# EAGLE design 605_motor (EAGLE 9.6.2)
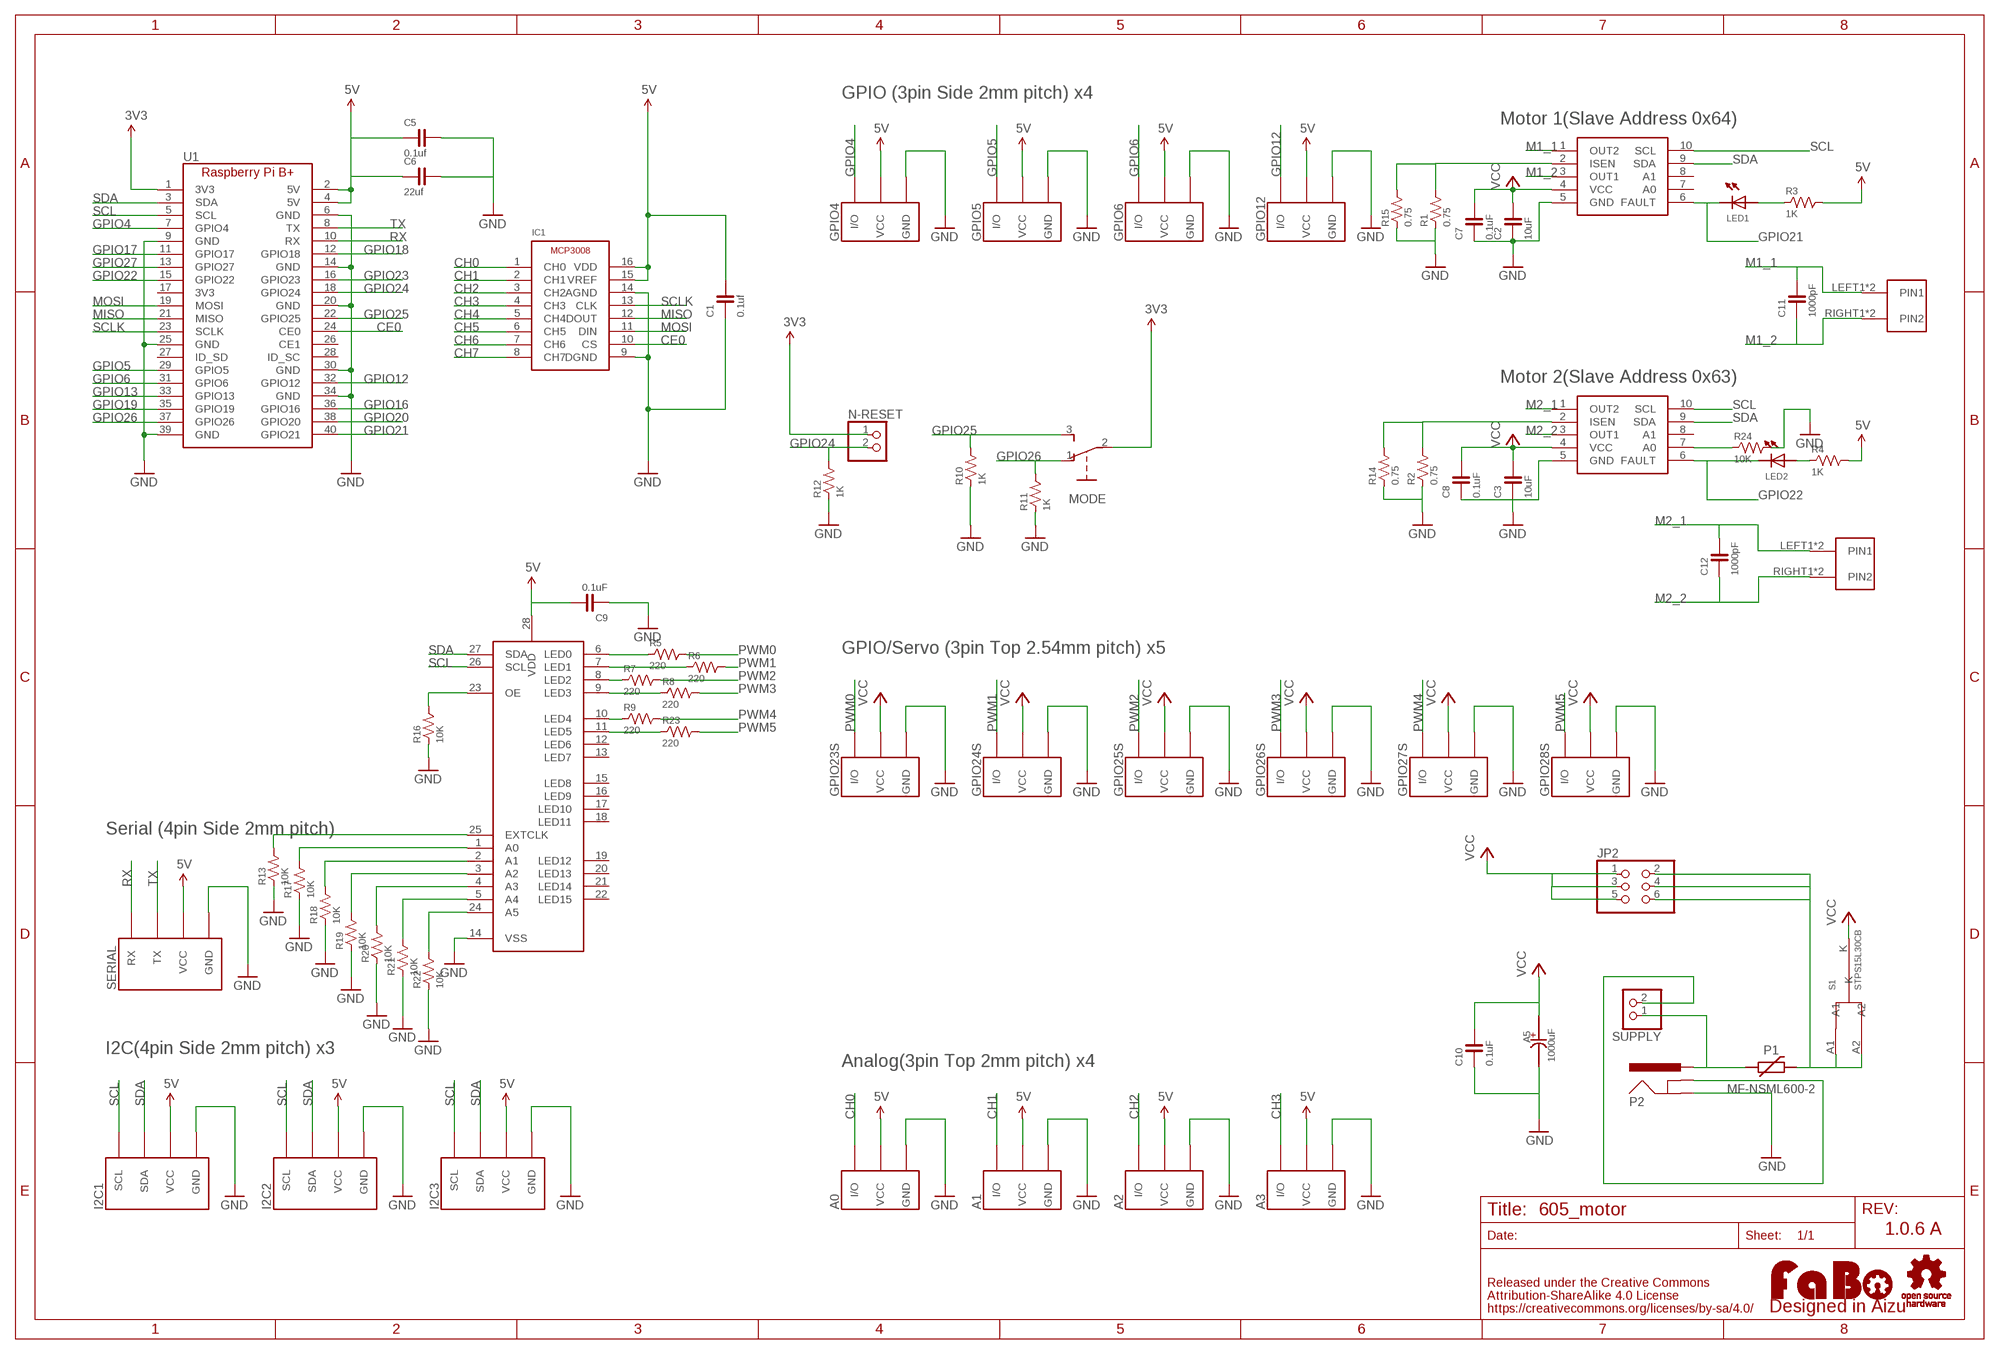
[diagram p0: schematic, sheet 1]

## Parts
A0  FABO_BRICK_3PIN-B03B-PASK-1  [FABO_BRICK_3PIN_B03B-PASK-1]
A1  FABO_BRICK_3PIN-B03B-PASK-1  [FABO_BRICK_3PIN_B03B-PASK-1]
A2  FABO_BRICK_3PIN-B03B-PASK-1  [FABO_BRICK_3PIN_B03B-PASK-1]
A3  FABO_BRICK_3PIN-B03B-PASK-1  [FABO_BRICK_3PIN_B03B-PASK-1]
A5  1000uF  CAPACITOR-ALUMIN_D12_5  [D12.5]
C1  0.1uf  CAPACITOR-0603  [0603]
C2  10uF  CAPACITOR-0603  [0603]
C3  10uF  CAPACITOR-0603  [0603]
C5  0.1uf  CAPACITOR-0603  [0603]
C6  22uf  CAPACITOR-0603  [0603]
C7  0.1uF  CAPACITOR-0603  [0603]
C8  0.1uF  CAPACITOR-0603  [0603]
C9  0.1uF  CAPACITOR-0603  [0603]
C10  0.1uF  CAPACITOR-0603  [0603]
C11  1000pF  CAPACITOR-0603  [0603]
C12  1000pF  CAPACITOR-0603  [0603]
GPIO4  FABO_BRICK_3PIN-S03B-PASK-2  [FABO_BRICK_3PIN_S03B-PASK-2]
GPIO5  FABO_BRICK_3PIN-S03B-PASK-2  [FABO_BRICK_3PIN_S03B-PASK-2]
GPIO6  FABO_BRICK_3PIN-S03B-PASK-2  [FABO_BRICK_3PIN_S03B-PASK-2]
GPIO12  FABO_BRICK_3PIN-S03B-PASK-2  [FABO_BRICK_3PIN_S03B-PASK-2]
GPIO23S  FABO_BRICK_3PIN-HEADER  [FABO_BRICK_3PIN_HEADER]
GPIO24S  FABO_BRICK_3PIN-HEADER  [FABO_BRICK_3PIN_HEADER]
GPIO25S  FABO_BRICK_3PIN-HEADER  [FABO_BRICK_3PIN_HEADER]
GPIO26S  FABO_BRICK_3PIN-HEADER  [FABO_BRICK_3PIN_HEADER]
GPIO27S  FABO_BRICK_3PIN-HEADER  [FABO_BRICK_3PIN_HEADER]
GPIO28S  FABO_BRICK_3PIN-HEADER  [FABO_BRICK_3PIN_HEADER]
I2C1  FABO_BRICK_I2C-S04B-PASK-2  [FABO_BRICK_I2C_S04B-PASK-2]
I2C2  FABO_BRICK_I2C-S04B-PASK-2  [FABO_BRICK_I2C_S04B-PASK-2]
I2C3  FABO_BRICK_I2C-S04B-PASK-2  [FABO_BRICK_I2C_S04B-PASK-2]
IC1  MICROCHIP-MCP3008  [MICROCHIP-MCP3008]
JP2  PINHD-2X3  [2X03]
LED1  LED-0603  [0603]
LED2  LED-0603  [0603]
LOGO1  LOGO_FABO-M  [LOGO_FABO_M]
MODE  SLIDE-EG1218  [EG1218]
N-RESET  PINHD-1X2  [1X02]
P1  MF-NSML600-2  POLYSWITCH1206  [1206]
P2  DC-JACKM04339A0  [M04339A0]
R1  0.75  RESISTOR-0603  [0603]
R2  0.75  RESISTOR-0603  [0603]
R3  1K  RESISTOR-0603  [0603]
R4  1K  RESISTOR-0603  [0603]
R5  220  RESISTOR-0603  [0603]
R6  220  RESISTOR-0603  [0603]
R7  220  RESISTOR-0603  [0603]
R8  220  RESISTOR-0603  [0603]
R9  220  RESISTOR-0603  [0603]
R10  1K  RESISTOR-0603  [0603]
R11  1K  RESISTOR-0603  [0603]
R12  1K  RESISTOR-0603  [0603]
R13  10K  RESISTOR-0402  [0402]
R14  0.75  RESISTOR-0603  [0603]
R15  0.75  RESISTOR-0603  [0603]
R16  10K  RESISTOR-0603  [0603]
R17  10K  RESISTOR-0603  [0603]
R18  10K  RESISTOR-0603  [0603]
R19  10K  RESISTOR-0603  [0603]
R20  10K  RESISTOR-0603  [0603]
R21  10K  RESISTOR-0603  [0603]
R22  10K  RESISTOR-0402  [0402]
R23  220  RESISTOR-0603  [0603]
R24  10K  RESISTOR-0603  [0603]
S1  STPS15L30CB  STPS15L30C  [STPS15L30C]
SERIAL  FABO_BRICK_SERIAL-S04B-PASK-2  [FABO_BRICK_SERIAL_S04B-PASK-2]
SUPPLY  PINHD-1X2  [1X02]
U1  RASPBERRY_PI_B+  [RASPBERRY_PI_B+]
U$4  LOGO_OSHW-M  [LOGO_OSHW_M]
U$8  DRV8830  [DRV8830]
U$9  PCA9685  [PCA9685]
U$10  DRV8830  [DRV8830]
U$12  ML-1400-S1  [ML-1400-S1]
U$13  ML-1400-S1  [ML-1400-S1]

## Nets
3V3: MODE.2 N-RESET.1 U1.1(3V3)
5V: A0.VCC A1.VCC A2.VCC A3.VCC C1.2 C5.1 C6.1 C9.2 GPIO4.VCC GPIO5.VCC GPIO6.VCC GPIO12.VCC I2C1.VCC I2C2.VCC I2C3.VCC IC1.15(VREF) IC1.16(VDD) R3.2 R4.2 SERIAL.VCC U1.2(5V) U1.4(5V) U$9.28(VDD)
CE0: IC1.10(CS) U1.24(CE0)
CH0: A0.I/O IC1.1(CH0)
CH1: A1.I/O IC1.2(CH1)
CH2: A2.I/O IC1.3(CH2)
CH3: A3.I/O IC1.4(CH3)
CH4: IC1.5(CH4)
CH5: IC1.6(CH5)
CH6: IC1.7(CH6)
CH7: IC1.8(CH7)
GND: A0.GND A1.GND A2.GND A3.GND A5.- C1.1 C2.1 C3.1 C5.2 C6.2 C7.1 C8.1 C9.1 C10.1 GPIO4.GND GPIO5.GND GPIO6.GND GPIO12.GND GPIO23S.GND GPIO24S.GND GPIO25S.GND GPIO26S.GND GPIO27S.GND GPIO28S.GND I2C1.GND I2C2.GND I2C3.GND IC1.9(DGND) IC1.14(AGND) P2.GND R1.1 R2.1 R10.1 R11.1 R12.1 R13.P$1 R14.1 R15.1 R16.1 R17.1 R18.1 R19.1 R20.1 R21.1 R22.P$1 R24.2 SERIAL.GND U1.6(GND) U1.9(GND) U1.14(GND) U1.20(GND) U1.25(GND) U1.30(GND) U1.34(GND) U1.39(GND) U$8.5(GND) U$9.14(VSS) U$10.5(GND)
GPIO4: GPIO4.I/O U1.7(GPIO4)
GPIO5: GPIO5.I/O U1.29(GPIO5)
GPIO6: GPIO6.I/O U1.31(GPIO6)
GPIO12: GPIO12.I/O U1.32(GPIO12)
GPIO13: U1.33(GPIO13)
GPIO16: U1.36(GPIO16)
GPIO17: U1.11(GPIO17)
GPIO18: U1.12(GPIO18)
GPIO19: U1.35(GPIO19)
GPIO20: U1.38(GPIO20)
GPIO21: LED1.CATHODE U1.40(GPIO21) U$8.6(FAULT)
GPIO22: LED2.CATHODE U1.15(GPIO22) U$10.6(FAULT)
GPIO23: U1.16(GPIO23)
GPIO24: N-RESET.2 R12.2 U1.18(GPIO24)
GPIO25: MODE.3 R10.2 U1.22(GPIO25)
GPIO26: MODE.1 R11.2 U1.37(GPIO26)
GPIO27: U1.13(GPIO27)
LED0: R5.1 U$9.6(LED0)
LED1: R6.1 U$9.7(LED1)
LED2: R7.1 U$9.8(LED2)
LED3: R8.1 U$9.9(LED3)
LED4: R9.1 U$9.10(LED4)
LED5: R23.1 U$9.11(LED5)
M1_1: C11.2 U$8.1(OUT2) U$12.LEFT1(PIN1) U$12.LEFT2(PIN1)
M1_2: C11.1 U$8.3(OUT1) U$12.RIGHT1(PIN2) U$12.RIGHT2(PIN2)
M2_1: C12.2 U$10.1(OUT2) U$13.LEFT1(PIN1) U$13.LEFT2(PIN1)
M2_2: C12.1 U$10.3(OUT1) U$13.RIGHT1(PIN2) U$13.RIGHT2(PIN2)
MISO: IC1.12(DOUT) U1.21(MISO)
MOSI: IC1.11(DIN) U1.19(MOSI)
N$2: R1.2 R15.2 U$8.2(ISEN)
N$3: R2.2 R14.2 U$10.2(ISEN)
N$4: LED1.ANODE R3.1
N$5: P1.P$1 P2.VCC(PWR) SUPPLY.1
N$6: LED2.ANODE R4.1
N$7: R16.2 U$9.23(OE)
N$8: R13.P$2 U$9.25(EXTCLK)
N$9: R17.2 U$9.1(A0)
N$10: R18.2 U$9.2(A1)
N$11: R19.2 U$9.3(A2)
N$12: R20.2 U$9.4(A3)
N$13: R21.2 U$9.5(A4)
N$14: R22.P$2 U$9.24(A5)
N$15: JP2.2 JP2.4 JP2.6 P1.P$2 S1.A1 S1.A2
N$16: R24.1 U$10.7(A0)
N$17: P2.GNDBREAK SUPPLY.2
PWM0: GPIO23S.I/O R5.2
PWM1: GPIO24S.I/O R6.2
PWM2: GPIO25S.I/O R7.2
PWM3: GPIO26S.I/O R8.2
PWM4: GPIO27S.I/O R9.2
PWM5: GPIO28S.I/O R23.2
RX: SERIAL.RX U1.10(RX)
SCL: I2C1.SCL I2C2.SCL I2C3.SCL U1.5(SCL) U$8.10(SCL) U$9.26(SCL) U$10.10(SCL)
SCLK: IC1.13(CLK) U1.23(SCLK)
SDA: I2C1.SDA I2C2.SDA I2C3.SDA U1.3(SDA) U$8.9(SDA) U$9.27(SDA) U$10.9(SDA)
TX: SERIAL.TX U1.8(TX)
VCC: A5.+ C2.2 C3.2 C7.2 C8.2 C10.2 GPIO23S.VCC GPIO24S.VCC GPIO25S.VCC GPIO26S.VCC GPIO27S.VCC GPIO28S.VCC JP2.1 JP2.3 JP2.5 S1.K U$8.4(VCC) U$10.4(VCC)
Unconnected: U1.17(3V3) U1.26(CE1) U1.27(ID_SD) U1.28(ID_SC) U$8.7(A0) U$8.8(A1) U$9.12(LED6) U$9.13(LED7) U$9.15(LED8) U$9.16(LED9) U$9.17(LED10) U$9.18(LED11) U$9.19(LED12) U$9.20(LED13) U$9.21(LED14) U$9.22(LED15) U$10.8(A1)

## Notes on the sheet
- GPIO (3pin Side 2mm pitch) x4
- Motor 1(Slave Address 0x64)
- Motor 2(Slave Address 0x63)
- GPIO/Servo (3pin Top 2.54mm pitch) x5
- Serial (4pin Side 2mm pitch)
- I2C(4pin Side 2mm pitch) x3
- Analog(3pin Top 2mm pitch) x4
- 1.0.6 A

## Library data of the parts
A0 A1-A3 GPIO4-GPIO6 GPIO12 GPIO23S GPIO24S GPIO25S GPIO26S GPIO27S GPIO28S = FaBo-Template:FABO_BRICK_3PIN: FaBo Brick 3pin
A5 = FaBo-Capacitor:CAPACITOR-ALUMIN
C1-C3 C5-C12 = FaBo-Capacitor:CAPACITOR: CAPACITOR
I2C1-I2C3 = FaBo-Template:FABO_BRICK_I2C: FaBo Brick I2C
IC1 = FaBo-ADC:MICROCHIP-MCP3008
JP2 = pinhead:PINHD-2X3: PIN HEADER
LED1 LED2 = FaBo-LED:LED
LOGO1 = component:LOGO_FABO
MODE = FaBo-Switch:SLIDE
N-RESET SUPPLY = pinhead:PINHD-1X2: PIN HEADER
P1 = FaBo-Supply:POLYSWITCH
P2 = FaBo-Supply:DC-JACK
R1-R24 = FaBo-Resistors:RESISTOR: RESISTOR
S1 = FaBo-Supply:STPS15L30C
SERIAL = FaBo-Template:FABO_BRICK_SERIAL: FaBo Brick Serial
U1 = FaBo-Boards:RASPBERRY_PI_B+
U$4 = component:LOGO_OSHW
U$8 U$10 = FaBo-Motor:DRV8830
U$9 = FaBo-Motor:PCA9685
U$12 U$13 = FaBo-Terminal:ML-1400-S1

## Board
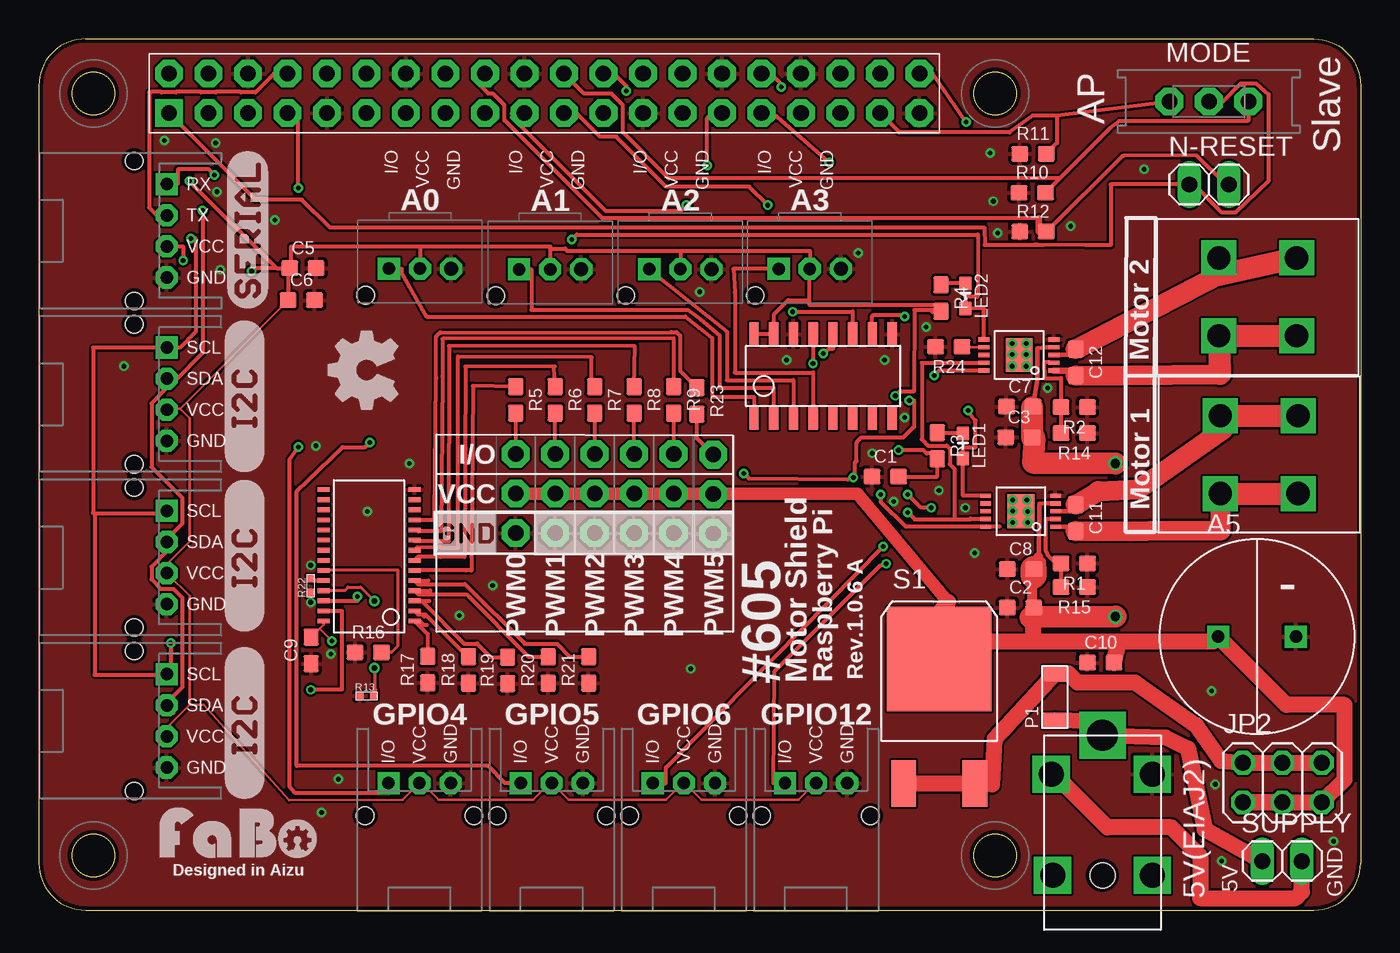
[diagram p1: board, top side]
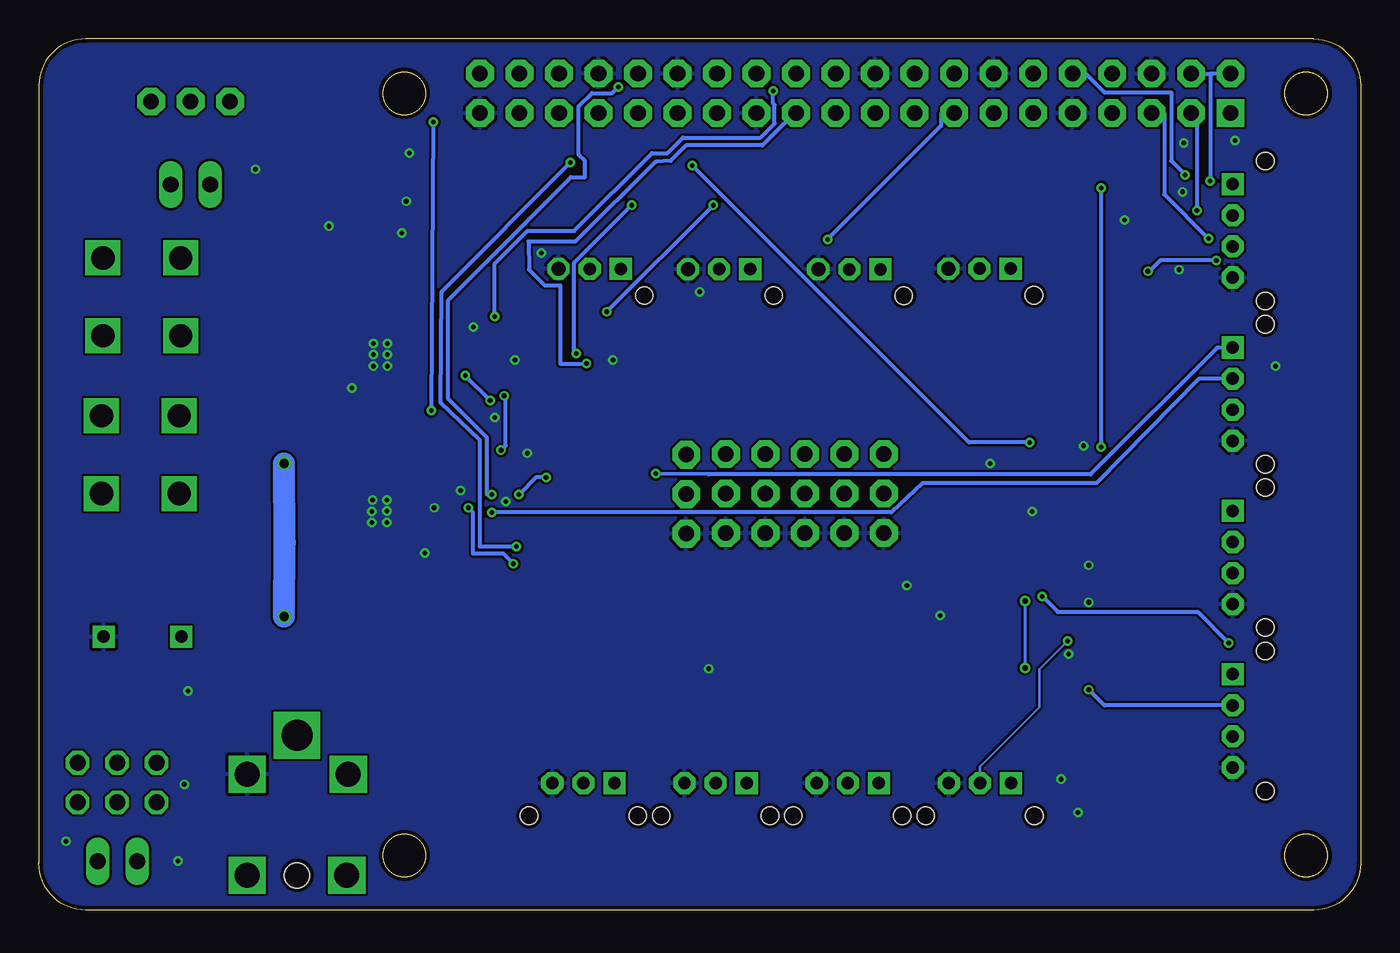
[diagram p2: board, bottom side, seen from below]

Size 85 x 56 mm. Coordinates in mm from the lower left corner, seen from the top.
Copper layers (1*16): Top 0.035mm / dielectric 1.6mm / Bottom 0.035mm
Design rules "PCBway": minimum track width 6mil, minimum drill 12mil, track to track 6mil, track to pad 6mil, pad to pad 6mil, via to via 6mil, smd to smd 6mil, copper to edge 10mil, drill to drill 10mil, minimum pad ring 10mil, minimum via ring 6mil, stop-mask expansion 2mil, vias tented up to drill 100mil, thermal gap 8mil

### Footprints (pad centres in the part's own frame; a part is rotated, then mirrored left to right if it is on the bottom)
FABO_BRICK_3PIN_B03B-PASK-1 = drill 0.9 pad 1.422 octagon: GND -2,0 | drill 0.8 pad 1.422 square: I/O 2,0 | drill 0.8 pad 1.422 octagon: VCC 0,0 | hole 1.1: 3.5,1.7
D12.5 = drill 0.8 pad 1.422 square: + -2.472,0.254; - 2.528,0.254
0603 = smd 1.1 x 1: 1 -0.85,0; 2 0.85,0
FABO_BRICK_3PIN_S03B-PASK-2 = drill 0.8 pad 1.422 octagon: GND -2,0; VCC 0,0 | drill 0.8 pad 1.422 square: I/O 2,0 | hole 1.1: 3.5,2.1; -3.5,2.1
FABO_BRICK_3PIN_HEADER = drill 1 pad 1.778 octagon: GND -2.54,0; I/O 2.54,0; VCC 0,0
FABO_BRICK_I2C_S04B-PASK-2 = drill 0.8 pad 1.422 octagon: GND -3,0; SDA 1,0; VCC -1,0 | drill 0.8 pad 1.422 square: SCL 3,0 | hole 1.1: 4.5,2.1; -4.5,2.1
MICROCHIP-MCP3008 = smd 0.6 x 1.5: 1 -4.445,-2.7; 2 -3.175,-2.7; 3 -1.905,-2.7; 4 -0.635,-2.7; 5 0.635,-2.7; 6 1.905,-2.7; 7 3.175,-2.7; 8 4.445,-2.7; 9 4.445,2.7; 10 3.175,2.7; 11 1.905,2.7; 12 0.635,2.7; 13 -0.635,2.7; 14 -1.905,2.7; 15 -3.175,2.7; 16 -4.445,2.7
2X03 = drill 1.016 octagon: 1 -2.54,-1.27; 2 -2.54,1.27; 3 0,-1.27; 4 0,1.27; 5 2.54,-1.27; 6 2.54,1.27
0603' = smd 0.9 x 0.8: ANODE -0.8,0; CATHODE 0.8,0
EG1218 = drill 1 pad 1.778 octagon: 1 -2.54,0; 2 0,0; 3 2.54,0
1X02 = drill 1.016 long: 1 -1.27,0; 2 1.27,0
1206 = smd 1 x 1.6: P$1 -1.5,0; P$2 1.5,0
M04339A0 = drill 1.6 square: GND -3.2,-6.5; GNDBREAK 3.3,-6.5; ND1 -3.2,0; ND2 3.2,0 | drill 2 square: VCC 0,-9 | hole 1.6: 0,0
0402 = smd 0.5 x 0.5: P$1 -0.46,0; P$2 0.46,0
STPS15L30C = smd 1.6 x 3: A1 -2.286,-6.13; A2 2.286,-6.13 | smd 6.7 x 6.7: K 0,1.87
FABO_BRICK_SERIAL_S04B-PASK-2 = drill 0.8 pad 1.422 octagon: GND -3,0; TX 1,0; VCC -1,0 | drill 0.8 pad 1.422 square: RX 3,0 | hole 1.1: 4.5,2.1; -4.5,2.1
RASPBERRY_PI_B+ = drill 1 pad 1.778 square: 1 0,-2.54 | drill 1 pad 1.778 octagon: 2 0,0; 3 2.54,-2.54; 4 2.54,0; 5 5.08,-2.54; 6 5.08,0; 7 7.62,-2.54; 8 7.62,0; 9 10.16,-2.54; 10 10.16,0; 11 12.7,-2.54; 12 12.7,0; 13 15.24,-2.54; 14 15.24,0; 15 17.78,-2.54; 16 17.78,0; 17 20.32,-2.54; 18 20.32,0; 19 22.86,-2.54; 20 22.86,0; 21 25.4,-2.54; 22 25.4,0; 23 27.94,-2.54; 24 27.94,0; 25 30.48,-2.54; 26 30.48,0; 27 33.02,-2.54; 28 33.02,0; 29 35.56,-2.54; 30 35.56,0; 31 38.1,-2.54; 32 38.1,0; 33 40.64,-2.54; 34 40.64,0; 35 43.18,-2.54; 36 43.18,0; 37 45.72,-2.54; 38 45.72,0; 39 48.26,-2.54; 40 48.26,0
DRV8830 = smd 0.27 x 0.7: 1 -1,-2.24; 2 -0.5,-2.24; 3 0,-2.24; 4 0.5,-2.24; 5 1,-2.24; 6 1,2.26; 7 0.5,2.26; 8 0,2.26; 9 -0.5,2.26; 10 -1,2.26 | smd 2.18 x 1.72: P$1 0,0
PCA9685 = smd 0.3 x 0.75: 1 -4.15,-2.93; 2 -3.5,-2.93; 3 -2.85,-2.93; 4 -2.2,-2.93; 5 -1.55,-2.93; 6 -0.9,-2.93; 7 -0.25,-2.93; 8 0.4,-2.93; 9 1.05,-2.93; 10 1.7,-2.93; 11 2.35,-2.93; 12 3,-2.93; 13 3.65,-2.93; 14 4.3,-2.93; 15 4.3,2.92; 16 3.65,2.92; 17 3,2.92; 18 2.35,2.92; 19 1.7,2.92; 20 1.05,2.92; 21 0.4,2.92; 22 -0.25,2.92; 23 -0.9,2.92; 24 -1.55,2.92; 25 -2.2,2.92; 26 -2.85,2.92; 27 -3.5,2.92; 28 -4.15,2.92
ML-1400-S1 = drill 1.5 square: LEFT1 -2.5,2.5; LEFT2 -2.5,-2.5; RIGHT1 2.5,2.5; RIGHT2 2.5,-2.5

### Placement (x,y rotation side)
A0  24.51,41.23 180 top
A1  32.88,41.19 180 top
A2  41.25,41.2 180 top
A3  49.57,41.21 180 top
A5  78.31,17.32 0 top
C1  54.43,27.86 0 top
C2  63.13,19.44 0 top
C3  63.03,30.39 0 top
C5  16.98,41.26 0 top
C6  16.88,39.21 0 top
C7  63.08,32.36 0 top
C8  63.13,21.91 0 top
C9  17.51,16.69 90 top
C10  68.29,15.9 0 top
C11  66.68,25.21 270 top
C12  66.68,35.21 270 top
GPIO4  24.48,8.16 180 top
GPIO5  32.98,8.16 180 top
GPIO6  41.48,8.16 180 top
GPIO12  49.98,8.16 180 top
GPIO23S  30.66,26.77 90 top
GPIO24S  33.2,26.77 90 top
GPIO25S  35.74,26.77 90 top
GPIO26S  38.28,26.77 90 top
GPIO27S  40.82,26.77 90 top
GPIO28S  43.37,26.73 90 top
I2C1  8.23,33.16 90 top
I2C2  8.23,22.66 90 top
I2C3  8.23,12.16 90 top
IC1  50.43,34.33 0 top
JP2  79.97,8.19 0 top
LED1  [0603']  59.42,29.84 270 top
LED2  [0603']  59.57,39.48 270 top
LOGO1  12.81,2.97 0 top
MODE  75.24,51.97 0 top
N-RESET  75.25,46.64 0 top
P1  65.33,13.69 90 top
P2  68.4,2.23 180 top
R1  66.58,22.28 180 top
R2  66.58,32.33 180 top
R3  57.77,29.85 270 top
R4  58.02,39.34 270 top
R5  30.66,32.8 270 top
R6  33.2,32.8 270 top
R7  35.74,32.8 270 top
R8  38.28,32.8 270 top
R9  40.82,32.8 270 top
R10  63.88,46.11 0 top
R11  63.93,48.61 0 top
R12  63.93,43.61 0 top
R13  21.08,13.76 0 top
R14  66.58,30.66 180 top
R15  66.58,20.76 180 top
R16  21.18,16.56 0 top
R17  25.01,15.45 90 top
R18  27.63,15.44 90 top
R19  30.14,15.41 90 top
R20  32.75,15.43 90 top
R21  35.35,15.44 90 top
R22  17.48,20.85 90 top
R23  42.32,32.73 270 top
R24  58.52,36.21 180 top
S1  57.9,14.26 0 top
SERIAL  8.23,43.66 90 top
SUPPLY  79.95,3.14 0 top
U1  8.37,53.77 0 top
U$2  [LOGO_SILK_I2C]  14.48,17.91 90 top
U$3  [LOGO_SILK_SERIAL2]  14.73,38.66 90 top
U$4  21.07,34.72 90 top
U$5  [LOGO_SILK_I2C]  14.48,7.16 90 top
U$6  [LOGO_SILK_I2C]  14.48,28.16 90 top
U$7  [LOGO_SILK_GND]  25.58,22.96 0 top
U$8  63.14,25.64 90 top
U$9  21.23,22.73 90 top
U$10  63.04,35.68 90 top
U$12  78.48,29.27 90 top
U$13  78.38,39.42 90 top

### Tracks (layer width: path | path; a pad name or v marks a point on that pad's centre or on a via)
3V3
  Top 0.254: MODE.2 76.13,51.97 77.3,53.14 78.26,53.14 79.08,52.44 79.08,46.85 76.95,44.84 76.09,44.84 74.29,46.64 N-RESET.1 68.93,46.64 68.92,42.74 67.32,42.74 64.25,42.76 64,42.75 64.22,42.76 | 64.22,42.76 64.61,42.76 | U1.1 13.93,45.67 16.91,45.67 18.72,43.86 60.81,43.85 60.82,42.76 60.87,42.76 64.22,42.76
5V  (via drill 0.3)
  Top 0.152: U$9.28 18.31,18.34 18.05,18.08 | 18.05,18.08 C9.2 | 9.69,13.18 8.32,11.81 8.32,11.2 I2C3.VCC | 9.69,13.18 9.69,20.19 8.32,21.56 I2C2.VCC 8.32,21.72 8.32,22.33 9.69,23.7 9.69,31.62 9.08,32.23 | 9.08,32.23 8.32,32.23 I2C1.VCC | 9.08,32.23 15.94,39.09 C6.1 | v18.84,17.3 18.05,18.08 | GPIO12.VCC 49.92,8.15 48.86,7.09 42.61,7.09 41.54,8.15 GPIO6.VCC 41.39,8.15 40.32,7.09 34.07,7.09 33.01,8.15 GPIO5.VCC 32.86,8.15 31.79,7.09 25.69,7.09 24.63,8.15 GPIO4.VCC 23.41,7.09 16.09,7.06 10.6,13.18 9.69,13.18
  Top 0.203: R4.2 58.05,38.56
  Top 0.254: 15.28,41.26 C5.1 | v9.68,46.86 15.28,41.26 | C5.1 16.03,41.26 C6.1 | C5.1 16.23,41.26 16.23,42.66 24.51,42.66 | 24.51,42.66 A0.VCC | 24.51,42.66 32.88,42.66 32.88,42.51 | 32.88,42.51 A1.VCC | 32.88,42.51 33.84,42.51 33.98,42.38 41.16,42.38 | 41.16,42.38 41.18,42.36 41.25,42.36 A2.VCC | 41.16,42.38 49.57,42.38 A3.VCC 49.53,41.21 49.53,39.21 | 49.53,39.21 49.53,38.91 58.02,38.91 R4.2 58.08,38.49 | C1.2 57.77,27.86 R3.2 57.78,29.06 57.78,29.36 57.08,29.36 56.88,29.56 v55.28,29.56 | IC1.16 46.03,37.06 47.23,37.06 IC1.15 47.28,37.16 47.28,38.31 48.18,39.21 49.53,39.21 | v9.28,41.76 9.28,42.66 SERIAL.VCC | v13.68,41.06 13.88,41.26 15.28,41.26 | v55.08,33.06 55.38,33.36 56.28,33.36 56.29,38.57 58.05,38.56
  Top 0.406: 57.53,38.49 R4.2
  Bottom 0.152: v18.84,17.3 20.66,15.47 20.66,13.03 24.47,9.22 24.47,8.3 GPIO4.VCC
  Bottom 0.254: 9.68,53.76 v9.68,46.86 | 9.68,53.76 U1.2 | v9.28,41.76 12.88,41.76 13.58,41.06 v13.68,41.06 | v55.08,33.06 54.98,32.96 54.98,29.86 v55.28,29.56 | U1.4 9.68,53.77 9.68,53.76
CE0  (via drill 0.3)
  Top 0.254: v37.78,52.66 37.78,52.96 36.98,53.76 36.38,53.76 U1.24 | v55.68,38.16 55.58,38.26 53.68,38.26 53.58,38.16 53.58,37.06 IC1.10
  Bottom 0.254: v37.78,52.66 37.78,51.86 37.68,51.76 37.68,50.56 38.58,49.66 43.58,49.66 44.58,48.66 45.58,48.66 50.58,43.66 53.58,43.66 55.68,41.56 v55.68,38.16
CH0
  Top 0.254: IC1.1 45.98,31.66 45.98,32.99 43.29,32.98 43.3,36.78 42.48,37.42 41.57,38.14 24.94,38.14 23.33,40.96 23.33,41.21 22.53,41.21 A0.I/O
CH1
  Top 0.254: A1.I/O 31.68,41.19 31.68,38.56 41.74,38.57 42.57,37.95 43.8,36.91 43.79,33.58 47.25,33.56 IC1.2
CH2
  Top 0.254: A2.I/O 44.25,37.19 44.24,34.06 48.52,34.06 IC1.3
CH3
  Top 0.254: A3.I/O 44.67,41.21 44.75,39.69 44.75,34.54 49.79,34.54 IC1.4
GND  (via drill 0.3)
  other vias: 15.18,44.36 11.68,41.16 5.48,34.96 8.08,49.46 18.78,16.46 18.18,6.26 66.34,43.96 19.26,8.41 61.18,48.66 61.65,43.52 48.08,35.36 23.83,28.71 61.38,45.56 52.68,42.24 54.38,35.36 53.58,29.36 57.88,26.96 54.98,26.26 59.58,25.86 60.18,22.96 42.51,39.74 55.68,31.66 64.88,33.56 62.58,36.41 63.48,36.41 63.48,35.71 62.58,35.71 62.58,34.96 63.48,34.96 62.63,26.36 63.54,26.35 62.63,25.66 63.58,25.61 62.63,24.91 63.58,24.91 17.48,19.78 17.48,22.16 29.18,20.86 41.93,15.51 21.13,25.61 17.82,29.84 11.37,49.31 11.46,46.17 75.42,14.08 71.08,47.62 27.04,18.93 57.06,37.47 76.05,3.14 83.25,4.42 75.65,8.08
  pour Bottom: -0.52,-0.84 85.48,-0.84 85.48,56.16 -0.52,56.16
  pour Top: -0.52,-0.84 85.48,-0.84 85.48,56.16 -0.52,56.16
GPIO4  (via drill 0.3)
  Top 0.254: v16.68,46.41 16.68,51.16 16.63,51.21 16.03,51.21 U1.7 | v16.68,29.76 16.12,28.96 16.13,7.91 | 16.49,7.51 16.13,7.91 | 16.49,7.51 22.48,7.51 GPIO4.I/O | 16.49,7.51 16.13,7.91 | 16.13,7.91
  Bottom 0.254: v16.68,29.76 v16.68,46.41
GPIO5  (via drill 0.3)
  Top 0.254: v42.98,47.86 42.98,50.91 43.28,51.21 43.93,51.21 U1.29 | v21.28,30.06 20.98,29.76 19.53,29.76 16.58,26.91 16.58,9.26 28.88,9.26 29.98,8.16 GPIO5.I/O
  Bottom 0.254: v42.98,47.86 25.18,30.06 v21.28,30.06
GPIO6  (via drill 0.3)
  Top 0.254: v50.82,48.06 47.25,51.18 46.48,51.21 U1.31 | v54.29,23.36 40.33,9.16 40.33,8.16 GPIO6.I/O
  Bottom 0.254: v50.82,48.06 59.1,39.74 59.16,32.62 56.63,30.21 56.63,23.36 v54.29,23.36
GPIO12  (via drill 0.3)
  Top 0.254: v47.73,52.91 47.73,53.11 47.08,53.76 U1.32 | v55.88,26.71 56.73,25.86 v57.38,25.86 | v54.48,22.26 54.12,22.15 47.32,15.35 47.23,8.16 GPIO12.I/O
  Bottom 0.254: v47.73,52.91 48.13,52.51 49.43,52.51 50.28,51.66 50.28,48.56 49.88,48.16 49.88,47.11 50.78,47.11 58.68,39.21 58.68,32.86 56.18,30.36 56.18,26.71 v55.88,26.71 | v57.38,25.86 57.08,25.56 57.08,22.91 55.13,22.91 v54.48,22.26
GPIO21  (via drill 0.3)
  Top 0.254: U$8.6 59.42,26.64 LED1.CATHODE 59.43,29.16 59.43,29.71 59.48,29.76 60.23,29.76 60.23,31.46 v59.76,32.11 | v59.63,50.66 57.48,53.76 U1.40
  Bottom 0.254: v59.76,32.11 v59.63,50.66
GPIO22  (via drill 0.3)
  Top 0.254: U$10.6 60.78,38.65 LED2.CATHODE 59.58,38.76 59.58,39.41 60.33,39.41 60.38,39.46 60.38,43.41 34.58,43.41 v34.28,43.11
  Bottom 0.254: v34.28,43.11 26.98,50.41 26.98,51.21 26.18,51.21 U1.15
GPIO24
  Top 0.254: 76.32,46.64 74.44,48.52 69.72,48.48 R12.2 | 64.32,44.47 36.23,44.47 29.93,50.77 29.93,51.75 29.21,52.48 28.91,52.48 28.53,52.86 28.53,53.61 U1.18
  Top 0.406: N-RESET.2 76.32,46.64 | R12.2 64.32,43.61 64.32,44.47
GPIO25
  Top 0.254: MODE.3 77.78,50.76 77.74,50.72 69.48,50.72 68.88,50.26 65.66,47.04 | 65.66,47.04 R10.2 | 65.66,47.04 40.5,47.04 37.55,49.99 37.55,51.75 36.83,52.48 35.06,52.48 U1.22
GPIO26
  Top 0.254: MODE.1 65.48,51.06 | 65.48,51.06 63.91,51.06 62.42,49.99 55.33,49.99 U1.37 | 65.48,51.06 65.48,49.31 R11.2
LED0
  Top 0.254: R5.1 27.92,33.69 27.82,22.72 27.82,21.84 27.47,21.83 U$9.6
LED1
  Top 0.254: R6.1 33.14,34.93 33.16,34.95 27.44,34.94 27.37,22.7 25.82,22.7 24.38,22.7 U$9.7
LED2
  Top 0.254: R7.1 35.53,33.65 35.55,35.53 26.93,35.58 26.94,30.53 26.92,23.26 25.87,23.28 24.34,23.3 U$9.8
LED3
  Top 0.254: R8.1 38.33,36.23 26.37,36.26 26.36,23.71 24.16,23.71 U$9.9
LED4
  Top 0.254: R9.1 40.83,36.75 25.96,36.71 25.96,34.3 25.86,24.36 24.42,24.35 23.94,24.4 U$9.10
LED5
  Top 0.254: U$9.11 25.3,25.08 25.31,25.07 25.46,25.22 25.55,34.21 25.55,36.87 25.55,36.88 25.67,37 25.79,37.12 25.86,37.12 40.66,37.16 41,37.16 41.24,36.92 41.24,34.66 R23.1
M1_1
  Top 0.305: U$8.1 66.68,24.64 C11.2
  Top 1.27: C11.2 76,24.41 U$12.LEFT1
  Top 1.422: U$12.LEFT1 U$12.LEFT2
M1_2
  Top 0.305: U$8.3 66.68,25.64 C11.1
  Top 1.27: C11.1 68.13,26.92 70.7,27.04 76.2,30.91 U$12.RIGHT1
  Top 1.422: U$12.RIGHT1 U$12.RIGHT2
M2_1
  Top 0.406: U$10.1 66.68,34.68 C12.2
  Top 1.27: C12.2 75.96,34.45
  Top 1.422: 75.96,34.45 U$13.LEFT1 U$13.LEFT2
M2_2
  Top 0.305: U$10.3 66.68,35.68
  Top 0.406: 66.68,35.68 C12.1
  Top 1.27: C12.1 75.83,40.82
  Top 1.422: 75.83,40.87 U$13.RIGHT1 75.83,40.82 U$13.RIGHT2
MISO  (via drill 0.3)
  Top 0.254: v46.88,45.31 45.68,46.51 40.33,46.51 37.13,49.71 36.08,49.71 34.58,51.21 33.78,51.21 U1.21 | v50.43,35.77 50.78,36.06 51.03,36.06 51.08,36.11 51.08,37.01 IC1.12
  Bottom 0.254: v46.88,45.31 50.58,41.61 50.58,35.71 v50.43,35.77
MOSI  (via drill 0.3)
  Top 0.254: v48.48,38.46 52.33,38.46 52.33,37.06 IC1.11 | v41.63,45.31 41.28,44.96 36.43,44.96 30.43,50.96 30.43,51.21 31.23,51.21 U1.19
  Bottom 0.254: v41.63,45.31 v48.48,38.46
N$2
  Top 0.254: R1.2 65.4,22.28 64.89,22.79 64.85,22.91 64.75,23.11 64.76,25.14 65.01,25.14 U$8.2 | R1.2 R15.2
  Top 0.406: R1.2
N$3
  Top 0.254: U$10.2 65.03,35.18 65.03,35.21 64.65,35.21 64.65,34.2 65.73,34.2 R2.2 | R2.2 R14.2
  Top 0.406: R2.2
N$4
  Top 0.254: LED1.ANODE 57.77,30.64 R3.1
N$5
  Top 1.016: P1.P$1 67.55,12.14 P2.VCC 72.46,11.09 73.89,10.39 74.97,5.19 SUPPLY.1
N$6
  Top 0.254: LED2.ANODE 58.02,40.28 R4.1
N$7
  Top 0.2: R16.2 22.68,16.56 23.08,16.96 23.08,21.86 18.38,21.86 U$9.23
N$8  (via drill 0.35)
  Top 0.2: 21.68,14.16 21.58,14.26 v21.58,15.56 | v21.58,19.86 20.68,20.76 19.88,20.76 19.68,20.56 18.38,20.56 U$9.25
  Top 0.254: 21.58,14.26 21.58,13.8 R13.P$2
  Bottom 0.2: v21.58,19.86 v21.58,15.56
N$9
  Top 0.254: 24.95,18.33 24.75,18.33 24.5,18.58 U$9.1 25.01,17.73 R17.2
N$10
  Top 0.254: 24.8,18.86 24.65,19.01 | U$9.2 24.38,19.01 24.65,19.01 | R18.2 27.56,16.29 24.85,19.01 24.65,19.01
N$11
  Top 0.254: U$9.3 24.6,19.88 | 24.6,19.88 25.1,19.88 | 24.6,19.88 27.36,17.12 28.19,17.12 29.05,16.26 R19.2
N$12
  Top 0.254: 25.19,20.53 U$9.4 24.38,20.31 25.25,20.31 25.27,20.28 27.5,20.28 31.51,16.28 R20.2
N$13
  Top 0.254: 25.04,21.18 U$9.5 24.38,20.96 27.4,20.96 31.25,17.11 33.31,17.11 34.13,16.29 R21.2
N$14
  Top 0.254: U$9.24 17.54,21.18 R22.P$2
N$15
  Top 1.016: S1.A1 S1.A2 61.2,8.13 61.3,8.06 61.45,10.98 P1.P$2 66.23,15.19 66.78,14.63 70.49,14.63 74.41,11.88 76.01,9.58 JP2.2 JP2.6 JP2.4
N$16
  Top 0.152: U$10.7 59.4,36.18 R24.1
N$17
  Top 1.016: P2.GNDBREAK 65.3,8.73 68.72,5.31 72.83,5.31 74.69,3.45 74.69,0.76 80.82,0.76 81.22,1.16 SUPPLY.2
PWM0
  Top 0.254: R5.2 GPIO23S.I/O
PWM1
  Top 0.254: GPIO24S.I/O R6.2
PWM2
  Top 0.254: R7.2 GPIO25S.I/O
PWM3
  Top 0.254: GPIO26S.I/O R8.2
PWM4
  Top 0.254: R9.2 GPIO27S.I/O
PWM5
  Top 0.254: GPIO28S.I/O 42.32,30.32 R23.2
RX  (via drill 0.3)
  Top 0.254: SERIAL.RX 8.88,46.66 8.93,46.71 8.93,47.61 10.93,47.61 v11.28,47.26
  Bottom 0.254: v11.28,47.26 12.18,48.16 12.18,52.56 16.48,52.56 17.68,53.76 U1.10
SCL  (via drill 0.3)
  Top 0.254: v9.78,43.16 10.08,43.16 10.08,37.16 9.08,36.16 I2C1.SCL 3.48,36.16 3.48,25.51 3.58,25.51 | v54.13,26.71 54.13,26.26 55.73,24.66 60.88,24.66 U$8.10 60.98,24.66 61.78,24.66 | v45.33,28.06 45.65,27.74 52.03,27.69 v52.38,27.81 52.48,27.86 52.48,28.76 52.58,28.86 52.58,30.06 52.88,30.36 55.58,30.36 56.28,31.06 56.28,32.76 v55.98,32.76 | 3.58,25.51 8.23,25.51 I2C2.SCL | 3.58,25.51 3.58,15.11 8.23,15.11 I2C3.SCL 8.48,15.16 v8.48,17.16 | U$9.26 20.48,19.88 v20.48,20.16 | 60.98,34.66 60.88,34.66 U$10.10 60.68,34.66 57.88,34.66 v57.58,34.36
  Bottom 0.254: v9.78,43.16 12.63,46.01 12.63,51.21 13.43,51.21 U1.5 | v54.13,26.71 53.03,27.81 v52.38,27.81 | v45.33,28.06 41.93,28.01 17.38,28.01 9.23,36.16 I2C1.SCL | v8.48,17.16 10.48,19.16 19.48,19.16 v20.48,20.16 | v57.58,34.36 v55.98,32.76
SCLK  (via drill 0.3)
  Top 0.254: 49.78,36.93 v49.78,35.13 | IC1.13 49.78,36.93 | 49.78,36.93 49.78,37.16
  Bottom 0.254: v49.78,35.13 51.48,35.13 51.48,40.16 52.48,40.16 53.48,41.16 53.51,42.96 50.51,42.96 45.34,48.1 44.37,48.16 43.37,49.16 38.48,49.16 36.48,51.16 U1.23
SDA  (via drill 0.3)
  Top 0.254: v10.53,44.96 10.53,35.81 8.88,34.16 I2C1.SDA 8.23,33.56 7.24,32.57 7.24,28.47 9.22,26.49 9.22,24.83 8.23,23.84 I2C2.SDA 8.23,23.06 7.24,22.07 7.24,21.25 7.84,20.65 8.64,20.65 9.22,20.07 9.22,14.33 8.63,13.74 8.63,12.66 8.23,12.66 I2C3.SDA | 58.88,25.11 56.33,25.11 v55.88,25.56 | 58.88,25.11 59.88,25.11 59.93,25.16 60.88,25.16 U$8.9 | v17.48,14.16 19.48,14.16 19.48,19.23 U$9.27 | 58.88,25.11 58.88,28.36 58.58,28.66 58.58,29.66 58.38,29.86 57.18,29.86 56.78,30.26 56.78,35.16 60.78,35.16 U$10.9
  Bottom 0.254: v10.53,44.96 10.53,51.21 10.88,51.21 U1.3 | v55.88,25.56 30.18,25.56 28.18,27.44 16.99,27.44 10.39,34.16 I2C1.SDA | v17.48,14.16 16.48,13.16 I2C3.SDA
TX
  Top 0.254: SERIAL.TX 7.58,44.66 7.08,45.16 7.08,52.56 7.18,52.56 7.23,52.61 7.83,52.61 7.88,52.56 8.83,52.56 8.88,52.61 10.38,52.61 10.43,52.56 11.38,52.56 11.43,52.61 12.93,52.61 12.98,52.56 13.93,52.56 15.13,53.76 U1.8
VCC  (via drill 0.6)
  Top 0.152: 63.75,19.91 63.73,19.91 C2.2
  Top 0.305: 64.31,22.78 64.33,26.12 64.73,26.14 | 64.73,26.14 64.91,26.15 | 64.79,36.17 64.21,36.11 64.21,34.66 64.21,34.1 C7.2 | 64.79,36.17 64.98,36.17 65,36.19 | U$10.4 64.8,36.18 64.79,36.17 | U$8.4 64.73,26.14 | 64.73,26.14 64.75,26.16 64.88,26.16
  Top 0.406: C2.2 63.98,21.51 63.83,20.66 | 63.78,18.81 63.75,19.91 63.73,20.96 | 64.31,22.78 64.08,22.41 64.28,22.71 | 64.31,22.78 64.18,22.61 | 64.31,22.78 64.28,22.11 64.28,22.36 64.13,22.21 63.88,21.96 | C8.2 64.13,21.91 | 64.01,30.36 C3.2 | 63.88,32.31 C7.2
  Top 0.61: 64.41,21.61 64.46,22.39 C8.2 64.13,22.21 64.28,22.71
  Top 0.813: GPIO23S.VCC GPIO24S.VCC GPIO25S.VCC GPIO26S.VCC GPIO27S.VCC | GPIO27S.VCC 52.62,26.77 58.46,19.82 | GPIO28S.VCC 43.33,26.77 GPIO27S.VCC
  Top 1.016: C10.2 69.14,15.88 69.45,17.26 | S1.K 57.95,17.4 | 57.95,17.4 58.01,19.21 58.46,19.82 | 69.45,17.26 75.52,17.26 A5.+ 80.22,13.19 83.97,13.19 83.97,8.38 JP2.5 JP2.1 JP2.3 | 57.95,17.4 58.09,17.26 63.94,17.25 | 69.45,17.26 69.44,17.25 63.94,17.25 | 63.94,17.25 63.94,19.4 C2.2
  Top 1.422: v69.23,28.71 63.93,28.76 64.01,30.36 | v69.23,18.86 63.78,18.81 | C3.2 63.88,32.31
  Top 1.676: 63.98,21.51 C8.2
  Bottom 1.422: v69.23,28.71 69.18,23.61 v69.23,18.86

### Text on the board
tPlace: AP | I/O | VCC | GND | I/O | VCC | GND | I/O | VCC | GND | I/O | VCC | GND | Slave | RX | TX | VCC | GND | SCL | Motor 2 | SDA | VCC | GND | I/O | VCC | Motor 1 | SCL | SDA | PWM0 | PWM1 | PWM2 | PWM3 | PWM4 | PWM5 | VCC | GND | SCL | Rev.1.0.6 A | #605 | Motor Shield | Raspberry Pi | SDA | VCC | GND | I/O | VCC | GND | I/O | VCC | GND | I/O | VCC | GND | I/O | VCC | GND | Designed in Aizu | 5V(EIAJ2) | 5V | GND